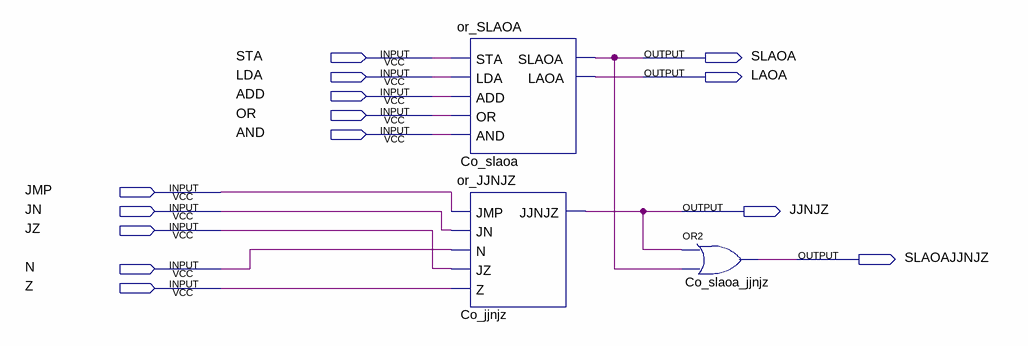
[diagram p0: schematic sheet]
// Quartus schematic or_SLAOAJJNJZ.bdf as structural Verilog: 3 symbols, 14 pins
module or_SLAOAJJNJZ (
  input  STA,
  input  LDA,
  input  ADD,
  input  OR,
  input  AND,
  input  JMP,
  input  JN,
  input  JZ,
  input  N,
  input  Z,
  output SLAOA,
  output LAOA,
  output JJNJZ,
  output SLAOAJJNJZ
);

  or_SLAOA Co_slaoa (.STA(STA), .LDA(LDA), .ADD(ADD), .OR(OR), .AND(AND), .SLAOA(SLAOA), .LAOA(LAOA));
  or_JJNJZ Co_jjnjz (.JMP(JMP), .JN(JN), .N(N), .JZ(JZ), .Z(Z), .JJNJZ(JJNJZ));
  or Co_slaoa_jjnjz (SLAOAJJNJZ, JJNJZ, SLAOA);
endmodule
